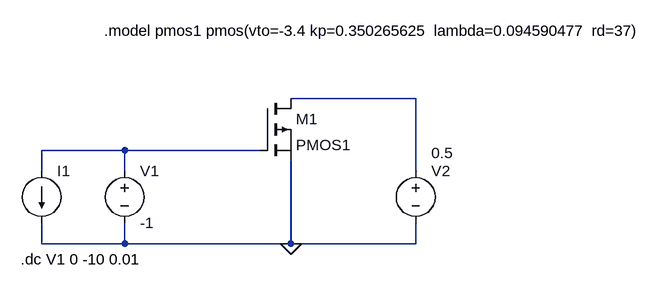
[diagram p0: schematic Exp_1.asc]
Exp_1.asc, the LTspice schematic file:
Version 4
SHEET 1 161040 680
WIRE 416 64 224 64
WIRE -32 144 -160 144
WIRE 176 144 -32 144
WIRE -160 176 -160 144
WIRE -32 176 -32 144
WIRE 416 176 416 64
WIRE -160 288 -160 256
WIRE -32 288 -32 256
WIRE -32 288 -160 288
WIRE 224 288 224 160
WIRE 224 288 -32 288
WIRE 416 288 416 256
WIRE 416 288 224 288
FLAG 224 288 0
SYMBOL voltage -32 160 R0
WINDOW 123 0 0 Left 0
WINDOW 39 0 0 Left 0
SYMATTR InstName V1
SYMATTR Value -1
SYMBOL pmos 176 64 R0
SYMATTR InstName M1
SYMATTR Value PMOS1
SYMBOL voltage 416 160 R0
WINDOW 3 24 -12 Left 2
WINDOW 123 0 0 Left 0
WINDOW 39 0 0 Left 0
SYMATTR Value 0.5
SYMATTR InstName V2
SYMBOL current -160 176 R0
WINDOW 3 24 28 Invisible 2
WINDOW 123 0 0 Left 0
WINDOW 39 0 0 Left 0
SYMATTR Value TBL(-6.2 -0.0136 -4.8 -0.0132 -4.3 -0.0127 -4.1 -0.0122 -3.9 -0.0116 -3.8 -0.0114 -3.7 -0.0104 -3.6 -0.01 -3.5 -0.0086 -3.42 -0.0074 -3.36 -0.0065 -3.2 -0.0024 -3 0 -2.6 0.0007)
SYMATTR InstName I1
TEXT -64 -40 Left 2 !.model pmos1 pmos(vto=-3.4 kp=0.350265625  lambda=0.094590477  rd=37)
TEXT -192 312 Left 2 !.dc V1 0 -10 0.01

The netlist it stands for:
* Exp_1.asc
V1 N002 0 -1
M1 N001 N002 0 0 PMOS1
V2 N001 0 0.5
I1 N002 0 TBL(-6.2 -0.0136 -4.8 -0.0132 -4.3 -0.0127 -4.1 -0.0122 -3.9 -0.0116 -3.8 -0.0114 -3.7 -0.0104 -3.6 -0.01 -3.5 -0.0086 -3.42 -0.0074 -3.36 -0.0065 -3.2 -0.0024 -3 0 -2.6 0.0007)
.model NMOS NMOS
.model PMOS PMOS
.lib standard.mos
.model pmos1 pmos(vto=-3.4 kp=0.350265625  lambda=0.094590477  rd=37)
.dc V1 0 -10 0.01
.backanno
.end